# EAGLE design SNES Mini SD (EAGLE 8.3.0)
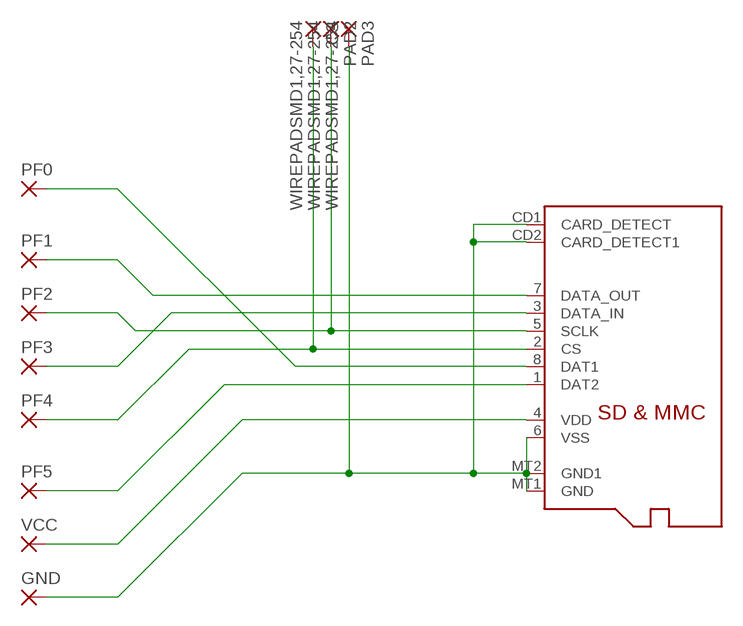
[diagram p0: schematic, sheet 1]

## Parts
CS  WIREPADSMD1,27-254  [SMD1,27-2,54]
GND  2,15/1,0  [2,15/1,0]
PAD2  WIREPADSMD1,27-254  [SMD1,27-2,54]
PAD3  WIREPADSMD1,27-254  [SMD1,27-2,54]
PF0  2,15/1,0  [2,15/1,0]
PF1  2,15/1,0  [2,15/1,0]
PF2  2,15/1,0  [2,15/1,0]
PF3  2,15/1,0  [2,15/1,0]
PF4  2,15/1,0  [2,15/1,0]
PF5  2,15/1,0  [2,15/1,0]
U$1  MICROSD  [MICROSD]
VCC  2,15/1,0  [2,15/1,0]

## Nets
GND: GND.1(P) PAD3.1(P) U$1.6(VSS) U$1.CD1(CARD_DETECT) U$1.CD2(CARD_DETECT1) U$1.MT1(GND) U$1.MT2(GND1)
N$1: PF0.1(P) U$1.8(DAT1)
N$2: PF1.1(P) U$1.7(DATA_OUT)
PF2: PAD2.1(P) PF2.1(P) U$1.5(SCLK)
PF3: PF3.1(P) U$1.3(DATA_IN)
PF4: CS.1(P) PF4.1(P) U$1.2(CS)
PF5: PF5.1(P) U$1.1(DAT2)
VDD: U$1.4(VDD) VCC.1(P)

## Library data of the parts
CS PAD2 PAD3 = wirepad:WIREPAD: Wire PAD connect wire on PCB
GND PF0 PF1-PF5 VCC = wirepad:2,15/1,0: THROUGH-HOLE PAD
U$1 = adafruit:MICROSD: Micro-SD / Transflash card holder with SPI pinout For the 3M # 2908-05WB-MG and/or 4UCON #19656 push-push type

## Board
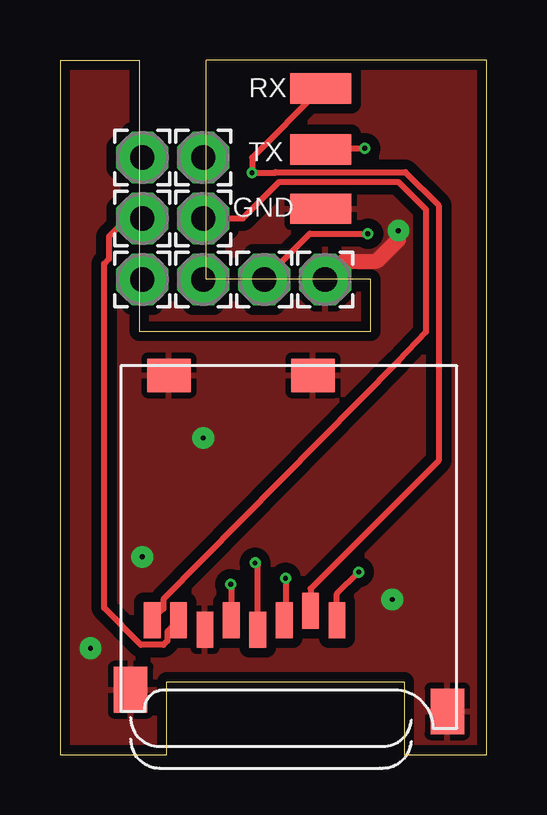
[diagram p1: board, top side]
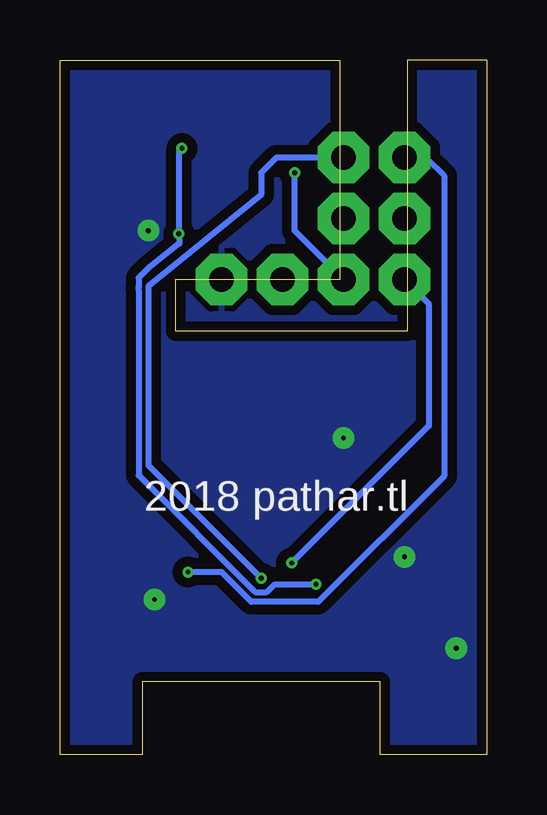
[diagram p2: board, bottom side, seen from below]

Size 17.78 x 28.96 mm. Coordinates in mm from the lower left corner, seen from the top.
Outline: 0,0 4.45,0 4.45,3.05 14.35,3.05 14.35,0 17.78,0 17.78,28.96 6.1,28.96 6.1,19.81 12.95,19.81 12.95,17.65 3.3,17.65 3.3,28.96 0,28.96 0,0
Copper layers (1*16): Top 0.035559375mm / dielectric 1.6mm / Bottom 0.035559375mm
Design rules "oshpark-2layer *": minimum track width 6mil, minimum drill 10mil, track to track 6mil, track to pad 6mil, pad to pad 6mil, via to via 6mil, smd to smd 6mil, copper to edge 10mil, drill to drill 6mil, minimum pad ring 5mil, minimum via ring 5mil, stop-mask expansion 2.5mil, vias tented up to drill 0mil, thermal gap 10mil

### Footprints (pad centres in the part's own frame; a part is rotated, then mirrored left to right if it is on the bottom)
SMD1,27-2,54 = smd 1.27 x 2.54: 1 0,0
2,15/1,0 = drill 1.016 pad 2.159 octagon: 1 0,0
MICROSD = smd 0.7 x 1.5: 1 9,-10.64; 2 7.9,-10.24; 3 6.8,-10.64; 4 5.7,-11.04; 5 4.6,-10.64; 6 3.5,-11.04; 7 2.4,-10.64; 8 1.3,-10.64 | smd 1.8 x 1.4: CD1 2,-0.44; CD2 8,-0.44 | smd 1.4 x 1.9: MT1 0.4,-13.54; MT2 13.6,-14.44

### Placement (x,y rotation side)
CS  10.87,27.76 90 top
GND  11.05,19.81 0 top
PAD2  10.87,25.22 90 top
PAD3  10.87,22.76 90 top
PF0  5.97,22.35 0 top
PF1  3.43,22.35 90 top
PF2  8.51,19.81 0 top
PF3  5.97,24.89 0 top
PF4  5.97,19.81 0 top
PF5  3.43,24.89 0 top
U$1  2.54,16.26 0 top
VCC  3.43,19.81 0 top

### Tracks (layer width: path | path; a pad name or v marks a point on that pad's centre or on a via)
GND  (via drill 0.2 pad 0.9)
  Top 0.635: GND.1 11.81,20.57 13.21,20.57 14.1,21.46 v14.1,21.84
  other vias: 5.97,13.21 3.43,8.25 13.84,6.48 1.27,4.44
  pour Bottom (isolate 0.406): -1.02,44.96 20.57,44.96 20.57,-4.7 -1.14,-4.7
  pour Top (isolate 0.406): -1.02,44.96 20.57,44.96 20.57,-4.7 -1.14,-4.7
N$1
  Top 0.254: PF0.1 7.62,22.35 9.14,23.88 14.1,23.88 15.24,22.73 15.24,17.62 14.1,16.39 4.31,6.48 4.31,6.09 U$1.8
N$2
  Top 0.254: U$1.7 4.47,5.15 4.47,4.75 4.31,4.59 3.37,4.59 1.84,6.12 1.84,20.47 2.03,20.67 2.03,21.59 2.79,22.35 PF1.1
PF2  (via drill 0.2)
  Top 0.254: PF2.1 10.41,21.72 v12.83,21.72 | PAD2.1 10.92,25.27 v12.7,25.27 | v7.11,7.11 7.14,7.08 U$1.5
  Bottom 0.254: v12.7,25.27 12.83,25.15 v12.83,21.72 12.8,21.31 14.06,20.32 14.5,19.88 14.5,19.54 14.52,19.4 14.5,19.38 14.5,11.65 9.64,6.78 9.16,6.78 8.83,7.11 v7.11,7.11
PF3  (via drill 0.2)
  Top 0.254: v9.4,7.37 9.4,5.67 U$1.3
  Bottom 0.254: PF3.1 8.76,24.89 9.4,24.26 9.4,23.33 14.1,19.52 14.1,12.07 v9.4,7.37
PF4  (via drill 0.2)
  Top 0.254: U$1.2 10.44,6.93 15.77,12.27 15.77,22.9 14.39,24.28 8.98,24.28 8.95,24.26 v8,24.26 8,24.89 CS.1
  Bottom 0.254: PF4.1 8,21.84 v8,24.26
PF5  (via drill 0.2)
  Top 0.254: U$1.1 11.54,6.71 v12.45,7.62
  Bottom 0.254: PF5.1 2.54,24.89 1.78,24.13 1.78,11.62 7.02,6.38 9.81,6.38 11.05,7.62 v12.45,7.62
VDD  (via drill 0.2)
  Top 0.254: U$1.4 8.24,7.89 v8.13,8
  Bottom 0.254: VCC.1 2.41,18.8 2.41,13.72 v8.13,8

### Text on the board
tPlace: RX | TX | GND
bNames: 2018 pathar.tl